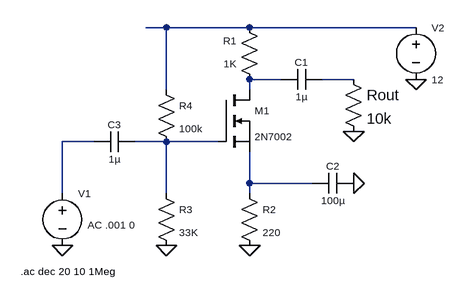
[diagram p0: schematic single_stage.asc]
single_stage.asc, the LTspice schematic file:
Version 4.1
SHEET 1 1104 1076
WIRE 80 16 48 16
WIRE 208 16 80 16
WIRE 464 16 208 16
WIRE 256 96 208 96
WIRE 368 96 320 96
WIRE 80 112 80 16
WIRE 208 112 208 96
WIRE -32 192 -80 192
WIRE 80 192 32 192
WIRE 160 192 80 192
WIRE 208 256 208 208
WIRE 304 256 208 256
WIRE -80 272 -80 192
WIRE 80 272 80 192
WIRE 208 272 208 256
FLAG 208 352 0
FLAG 80 352 0
FLAG -80 352 0
FLAG 464 96 0
FLAG 368 256 0
FLAG 368 176 0
SYMBOL nmos 160 112 R0
WINDOW 0 56 32 Left 1
WINDOW 3 56 72 Left 1
SYMATTR InstName M1
SYMATTR Value 2N7002
SYMBOL res 224 112 R180
WINDOW 0 36 76 Left 1
WINDOW 3 36 40 Left 1
SYMATTR InstName R1
SYMATTR Value 1K
SYMBOL cap 320 80 R90
WINDOW 0 0 32 VBottom 1
WINDOW 3 32 32 VTop 1
SYMATTR InstName C1
SYMATTR Value 1µ
SYMATTR SpiceLine V=16 Irms=0 Rser=11 Lser=0 mfg="AVX" pn="TAJA105K016" type="Tantalum"
SYMBOL cap 368 240 R90
WINDOW 0 0 32 VBottom 1
WINDOW 3 32 32 VTop 1
SYMATTR InstName C2
SYMATTR Value 100µ
SYMATTR SpiceLine V=16 Irms=0 Rser=11 Lser=0 mfg="AVX" pn="TAJA105K016" type="Tantalum"
SYMBOL res 192 256 R0
WINDOW 0 36 40 Left 1
WINDOW 3 36 76 Left 1
SYMATTR InstName R2
SYMATTR Value 220
SYMBOL res 64 256 R0
WINDOW 0 36 40 Left 1
WINDOW 3 36 76 Left 1
SYMATTR InstName R3
SYMATTR Value 33K
SYMBOL res 64 96 R0
WINDOW 0 36 40 Left 1
WINDOW 3 36 76 Left 1
SYMATTR InstName R4
SYMATTR Value 100k
SYMBOL cap 32 176 R90
WINDOW 0 0 32 VBottom 1
WINDOW 3 32 32 VTop 1
SYMATTR InstName C3
SYMATTR Value 1µ
SYMATTR SpiceLine V=16 Irms=0 Rser=11 Lser=0 mfg="AVX" pn="TAJA105K016" type="Tantalum"
SYMBOL voltage -80 256 R0
WINDOW 123 39 64 Left 1
WINDOW 39 0 0 Left 0
WINDOW 0 24 16 Left 1
SYMATTR Value2 AC .001 0
SYMATTR InstName V1
SYMATTR Value ""
SYMBOL voltage 464 0 R0
WINDOW 123 0 0 Left 0
WINDOW 39 0 0 Left 0
WINDOW 0 24 16 Left 1
WINDOW 3 24 96 Left 1
SYMATTR InstName V2
SYMATTR Value 12
SYMBOL res 352 80 R0
SYMATTR InstName Rout
SYMATTR Value 10k
TEXT -144 392 Left 1 !.ac dec 20 10 1Meg

The netlist it stands for:
* single_stage.asc
M1 N002 N005 N006 N006 2N7002
R1 N002 N001 1K
C1 N003 N002 1µ V=16 Irms=0 Rser=11 Lser=0 mfg="AVX" pn="TAJA105K016" type="Tantalum"
C2 0 N006 100µ V=16 Irms=0 Rser=11 Lser=0 mfg="AVX" pn="TAJA105K016" type="Tantalum"
R2 N006 0 220
R3 N005 0 33K
R4 N001 N005 100k
C3 N005 N004 1µ V=16 Irms=0 Rser=11 Lser=0 mfg="AVX" pn="TAJA105K016" type="Tantalum"
V1 N004 0 AC .001 0
V2 N001 0 12
Rout N003 0 10k
.model NMOS NMOS
.model PMOS PMOS
.lib standard.mos
.ac dec 20 10 1Meg
.backanno
.end